# EAGLE schematic SX1231 (EAGLE 7.1.0)
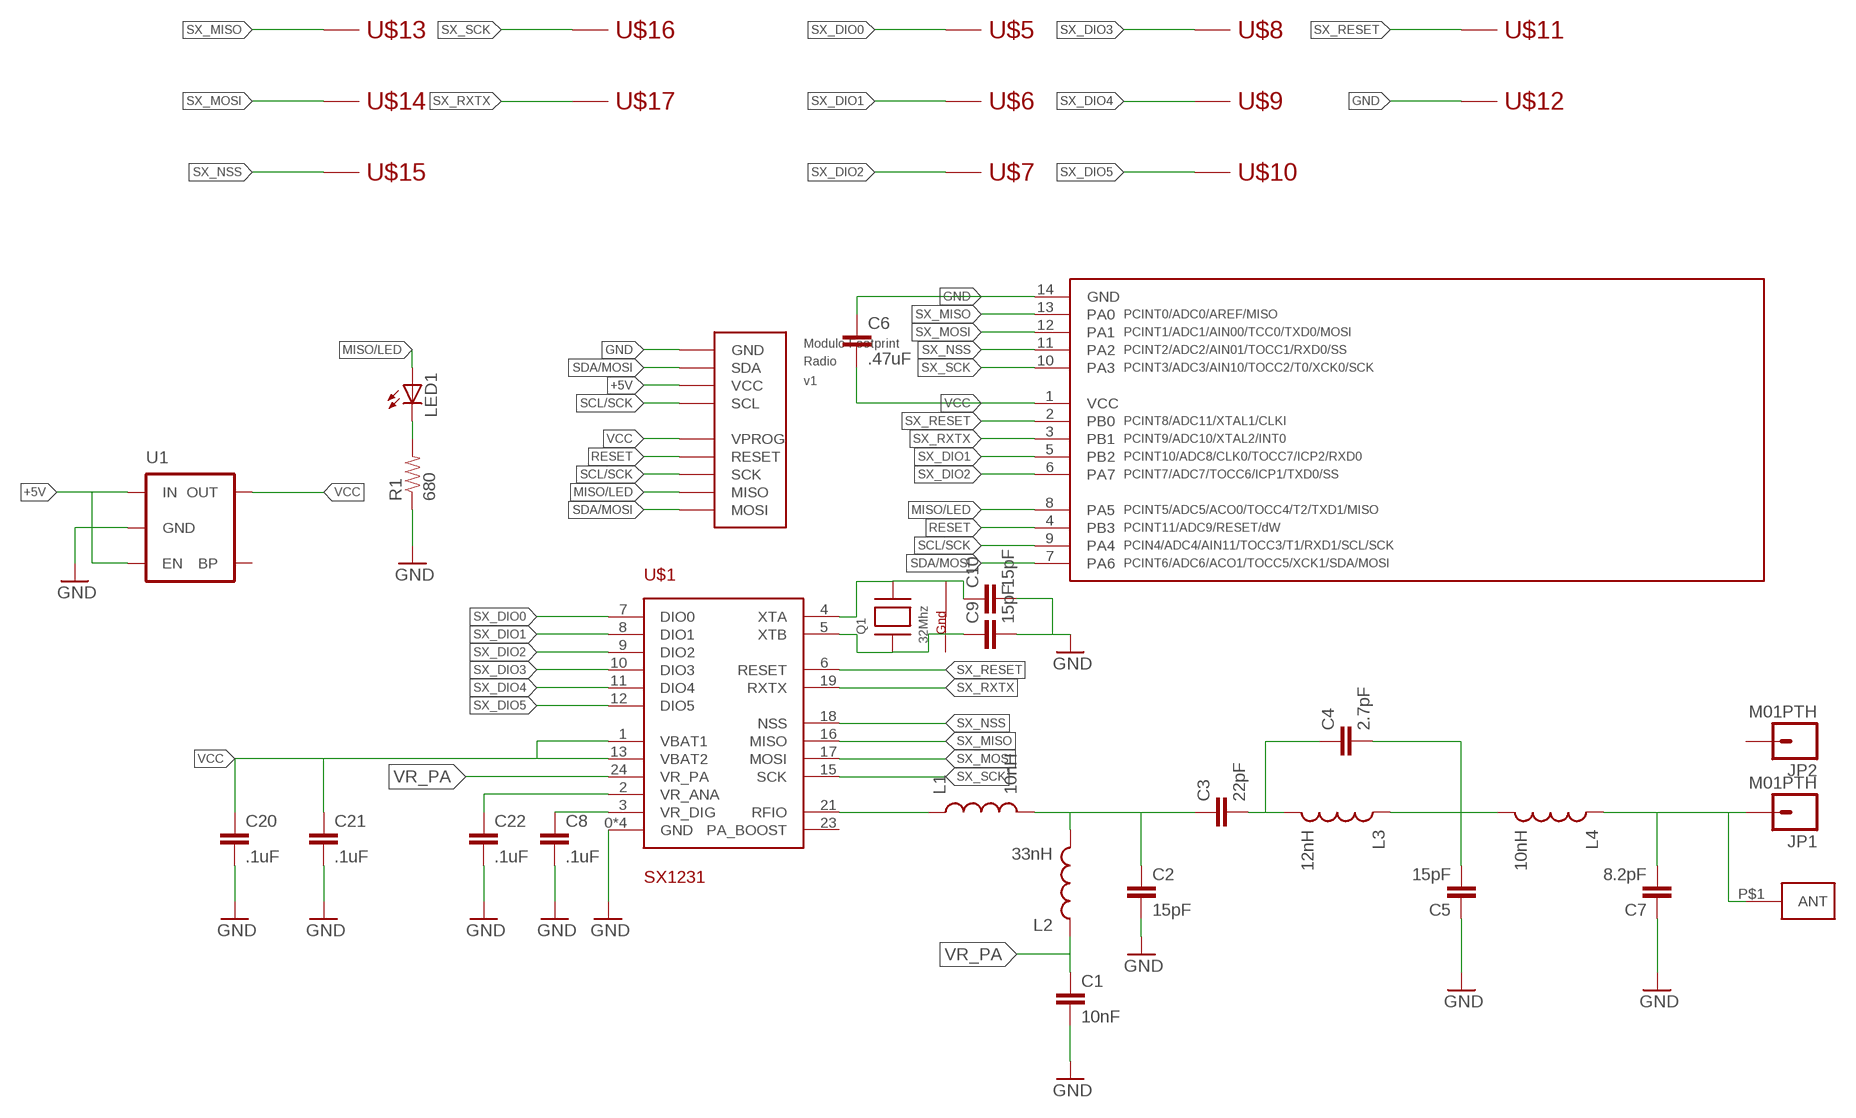
[diagram p0: schematic, sheet 1]

## Parts
C1  10nF  CAP0805  [0805]
C2  15pF  CAP0805  [0805]
C3  22pF  CAP0805  [0805]
C4  2.7pF  CAP0805  [0805]
C5  15pF  CAP0805  [0805]
C6  .47uF  CAP0805  [0805]
C7  8.2pF  CAP0805  [0805]
C8  .1uF  CAP0805  [0805]
C9  15pF  CAP0805  [0805]
C10  15pF  CAP0805  [0805]
C20  .1uF  CAP0805  [0805]
C21  .1uF  CAP0805  [0805]
C22  .1uF  CAP0805  [0805]
JP1  M01PTH  [1X01]
JP2  M01PTH  [1X01]
L1  10nH  INDUCTOR0805  [0805]
L2  33nH  INDUCTOR0805  [0805]
L3  12nH  INDUCTOR0805  [0805]
L4  10nH  INDUCTOR0805  [0805]
LED1  LEDCHIP-LED0805  [CHIP-LED0805]
Q1  32Mhz  XTAL-4-3225  [NX3225]
R1  680  RESISTOR0805  [0805]
U1  MIC52053.3V  [SOT23-5]
U$1  SX1231  [QFN-24]
U$2  FOOTPRINTFOOTPRINT-2  [FOOTPRINT2]
U$3  TINY841  [SOIC14]
U$4  ANTENNA  [ANT-433-PW-LP]
U$5  TESTPOINT  [TESTPOINT]
U$6  TESTPOINT  [TESTPOINT]
U$7  TESTPOINT  [TESTPOINT]
U$8  TESTPOINT  [TESTPOINT]
U$9  TESTPOINT  [TESTPOINT]
U$10  TESTPOINT  [TESTPOINT]
U$11  TESTPOINT  [TESTPOINT]
U$12  TESTPOINT  [TESTPOINT]
U$13  TESTPOINT  [TESTPOINT]
U$14  TESTPOINT  [TESTPOINT]
U$15  TESTPOINT  [TESTPOINT]
U$16  TESTPOINT  [TESTPOINT]
U$17  TESTPOINT  [TESTPOINT]

## Nets
+5V: U1.1(IN) U1.3(EN) U$2.BUS2(VCC)
GND: C1.2 C2.2 C5.1 C6.1 C7.1 C8.2 C9.2 C10.2 C20.2 C21.2 C22.2 R1.1 U1.2(GND) U$1.0(GND) U$1.14(GND) U$1.20(GND) U$1.22(GND) U$2.BUS0(GND) U$3.14(GND) U$12.P$1
MISO/LED: LED1.A U$2.PROG3(MISO) U$3.8(PA5)
N$2: C8.1 U$1.3(VR_DIG)
N$3: C9.1 Q1.1(X1) U$1.5(XTB)
N$4: C10.1 Q1.3(X2) U$1.4(XTA)
N$5: LED1.C R1.2
N$7: C22.1 U$1.2(VR_ANA)
N$8: L1.1 U$1.21(RFIO)
N$9: C2.1 C3.1 L1.2 L2.2
N$10: C3.2 C4.1 L3.2
N$11: C4.2 C5.2 L3.1 L4.2
N$12: C7.2 JP1.1 L4.1 U$4.P$1(ANT)
RESET: U$2.PROG1(RESET) U$3.4(PB3)
SCL/SCK: U$2.BUS3(SCL) U$2.PROG2(SCK) U$3.9(PA4)
SDA/MOSI: U$2.BUS1(SDA) U$2.PROG4(MOSI) U$3.7(PA6)
SX_DIO0: U$1.7(DIO0) U$5.P$1
SX_DIO1: U$1.8(DIO1) U$3.5(PB2) U$6.P$1
SX_DIO2: U$1.9(DIO2) U$3.6(PA7) U$7.P$1
SX_DIO3: U$1.10(DIO3) U$8.P$1
SX_DIO4: U$1.11(DIO4) U$9.P$1
SX_DIO5: U$1.12(DIO5) U$10.P$1
SX_MISO: U$1.16(MISO) U$3.13(PA0) U$13.P$1
SX_MOSI: U$1.17(MOSI) U$3.12(PA1) U$14.P$1
SX_NSS: U$1.18(NSS) U$3.11(PA2) U$15.P$1
SX_RESET: U$1.6(RESET) U$3.2(PB0) U$11.P$1
SX_RXTX: U$1.19(RXTX) U$3.3(PB1) U$17.P$1
SX_SCK: U$1.15(SCK) U$3.10(PA3) U$16.P$1
VCC: C6.2 C20.1 C21.1 U1.5(OUT) U$1.1(VBAT1) U$1.13(VBAT2) U$2.PROG0(VPROG) U$3.1(VCC)
VR_PA: C1.1 L2.1 U$1.24(VR_PA)
Unconnected: JP2.1 U1.4(BP) U$1.23(PA_BOOST)

## Power pins joined to a net without a drawn wire
G1: Q1.4(G1)
G2: Q1.2(G2)

## Library data of the parts
C1-C10 C20-C22 = IntegerLabs:CAP: Capacitor
JP1 JP2 = SparkFun-Connectors:M01: Header 1 Standard 1-pin 0.1" header. Use with straight break away headers (SKU : PRT-00116), right angle break away headers (PRT-00553), swiss pins (PRT-00743), machine pins (PRT-00117), and female headers (PRT-00115).
L1-L4 = IntegerLabs:INDUCTOR: Inductors Basic Inductor/Choke - 0603 and 1206. Footprints are not proven and vary greatly between part numbers. SRN6045- 33uH, 20% 1.4A SDR0403-560KL - 56uH, 10%, 500mA RMS/740mA peak
LED1 = adafruit:LED: LED OSRAM: - CHIPLED LG R971, LG N971, LY N971, LG Q971, LY Q971, LO R971, LY R971 LH N974, LH R974 LS Q976, LO Q976, LY Q976 LO Q996 - Hyper CHIPLED LW Q18S LB Q993, LB Q99A, LB R99A - SideLED LS A670, LO A670, LY A670, LG A670, LP A670 LB A673, LV A673, LT A673, LW A673 LH A674 LY A675 LS A676, LA A676, LO A676, LY A676, LW A676 LS A679, LY A679, LG A679 - Hyper Micro SIDELED® LS Y876, LA Y876, LO Y876, LY Y876 LT Y87S - SmartLED LW L88C, LW L88S LB L89C, LB L89S, LG L890 LS L89K, LO L89K, LY L89K LS L896, LA L896, LO L896, LY L896 - TOPLED LS T670, LO T670, LY T670, LG T670, LP T670 LSG T670, LSP T670, LSY T670, LOP T670, LYG T670 LG T671, LOG T671, LSG T671 LB T673, LV T673, LT T673, LW T673 LH T674 LS T676, LA T676, LO T676, LY T676, LB T676, LH T676, LSB T676, LW T676 LB T67C, LV T67C, LT T67C, LS T67K, LO T67K, LY T67K, LW E67C LS E67B, LA E67B, LO E67B, LY E67B, LB E67C, LV E67C, LT E67C LW T67C LS T679, LY T679, LG T679 LS T770, LO T770, LY T770, LG T770, LP T770 LB T773, LV T773, LT T773, LW T773 LH T774 LS E675, LA E675, LY E675, LS T675 LS T776, LA T776, LO T776, LY T776, LB T776 LHGB T686 LT T68C, LB T68C - Hyper Mini TOPLED® LB M676 - Mini TOPLED Santana® LG M470 LS M47K, LO M47K, LY M47K Source: http://www.osram.convergy.de/
Q1 = adafruit:XTAL-4: Classic 4-pin 3.2 x 2.5mm crystal
R1 = IntegerLabs:RESISTOR: Resistor Basic schematic elements and footprints for 0603, 1206, and PTH resistors.
U1 = SparkFun-PowerIC:MIC5205: MIC5205 150mA vreg 3.3V - VREG-00822 5V - VREG-00823; PROD_ID: VREG-00822
U$1 = IntegerLabs:SX1231
U$2 = IntegerLabs:FOOTPRINT: Modulo Footprint; BOARD: Radio; VERSION: v1
U$3 = IntegerLabs:TINY841
U$4 = IntegerLabs:ANTENNA
U$5-U$17 = IntegerLabs:TESTPOINT